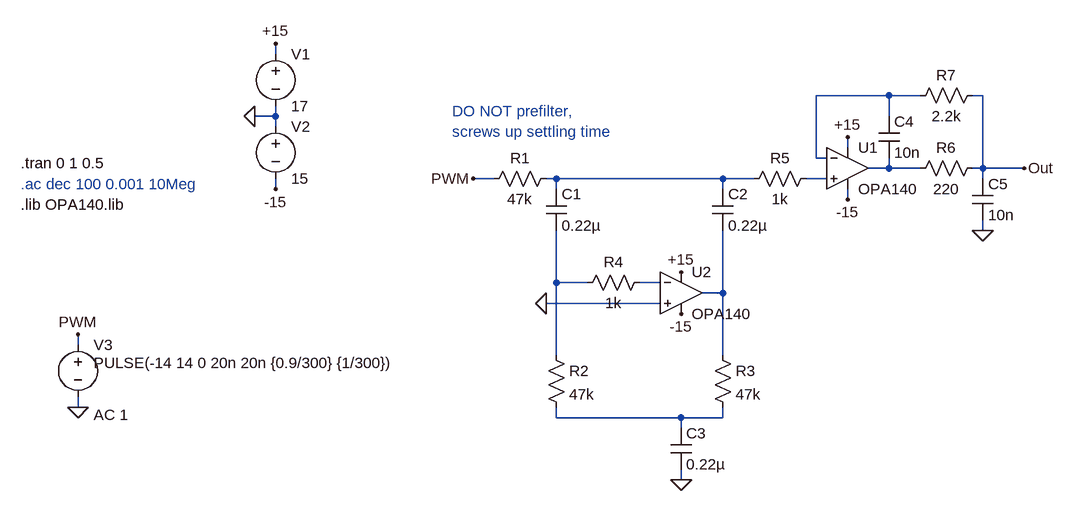
[diagram p0: schematic DC accurate LPF.asc]
DC accurate LPF.asc, the LTspice schematic file:
Version 4
SHEET 1 1356 1140
WIRE -320 -16 -320 -32
WIRE 624 48 512 48
WIRE 672 48 624 48
WIRE 768 48 752 48
WIRE -320 80 -320 64
WIRE -320 80 -352 80
WIRE 624 80 624 48
WIRE -320 96 -320 80
WIRE 560 128 560 112
WIRE 512 144 512 48
WIRE 528 144 512 144
WIRE 624 160 624 144
WIRE 624 160 592 160
WIRE 672 160 624 160
WIRE 768 160 768 48
WIRE 768 160 752 160
WIRE 832 160 768 160
WIRE 16 176 -16 176
WIRE 112 176 96 176
WIRE 368 176 112 176
WIRE 416 176 368 176
WIRE 528 176 496 176
WIRE 768 176 768 160
WIRE -320 192 -320 176
WIRE 112 192 112 176
WIRE 368 192 368 176
WIRE 560 208 560 192
WIRE 768 256 768 240
WIRE 112 336 112 256
WIRE 160 336 112 336
WIRE 272 336 240 336
WIRE 368 352 368 256
WIRE 368 352 336 352
WIRE 272 368 96 368
WIRE -624 432 -624 416
WIRE 112 448 112 336
WIRE 368 448 368 352
WIRE -624 528 -624 512
WIRE 112 544 112 528
WIRE 304 544 112 544
WIRE 368 544 368 528
WIRE 368 544 304 544
WIRE 304 560 304 544
WIRE 304 640 304 624
FLAG -352 80 0
FLAG 560 112 +15
FLAG 304 320 +15
FLAG 96 368 0
FLAG 304 640 0
FLAG 304 384 -15
FLAG -624 528 0
FLAG 832 160 Out
FLAG -320 -32 +15
FLAG -320 192 -15
FLAG 560 208 -15
FLAG -624 416 PWM
FLAG -16 176 PWM
FLAG 768 256 0
SYMBOL OpAmps\\opamp2 560 96 R0
SYMATTR InstName U1
SYMATTR Value OPA140
SYMBOL voltage -320 -32 R0
WINDOW 123 0 0 Left 0
WINDOW 39 0 0 Left 0
SYMATTR InstName V1
SYMATTR Value 17
SYMBOL voltage -320 80 R0
WINDOW 123 0 0 Left 0
WINDOW 39 0 0 Left 0
SYMATTR InstName V2
SYMATTR Value 15
SYMBOL res 112 160 R90
WINDOW 0 0 56 VBottom 2
WINDOW 3 32 56 VTop 2
SYMATTR InstName R1
SYMATTR Value 47k
SYMBOL cap 96 192 R0
SYMATTR InstName C1
SYMATTR Value 0.22µ
SYMBOL cap 352 192 R0
SYMATTR InstName C2
SYMATTR Value 0.22µ
SYMBOL OpAmps\\opamp2 304 288 R0
SYMATTR InstName U2
SYMATTR Value OPA140
SYMBOL res 96 432 R0
SYMATTR InstName R2
SYMATTR Value 47k
SYMBOL res 352 432 R0
SYMATTR InstName R3
SYMATTR Value 47k
SYMBOL voltage -624 416 R0
WINDOW 123 24 124 Left 2
WINDOW 39 0 0 Left 0
WINDOW 3 24 44 Left 2
SYMATTR Value2 AC 1
SYMATTR Value PULSE(-14 14 0 20n 20n {0.9/300} {1/300})
SYMATTR InstName V3
SYMBOL cap 288 560 R0
SYMATTR InstName C3
SYMATTR Value 0.22µ
SYMBOL res 256 320 R90
WINDOW 0 0 56 VBottom 2
WINDOW 3 32 56 VTop 2
SYMATTR InstName R4
SYMATTR Value 1k
SYMBOL res 512 160 R90
WINDOW 0 0 56 VBottom 2
WINDOW 3 32 56 VTop 2
SYMATTR InstName R5
SYMATTR Value 1k
SYMBOL res 768 144 R90
WINDOW 0 0 56 VBottom 2
WINDOW 3 32 56 VTop 2
SYMATTR InstName R6
SYMATTR Value 220
SYMBOL cap 752 176 R0
SYMATTR InstName C5
SYMATTR Value 10n
SYMBOL res 768 32 R90
WINDOW 0 0 56 VBottom 2
WINDOW 3 32 56 VTop 2
SYMATTR InstName R7
SYMATTR Value 2.2k
SYMBOL cap 608 80 R0
SYMATTR InstName C4
SYMATTR Value 10n
TEXT -712 216 Left 2 !.lib OPA140.lib
TEXT -712 184 Left 2 ;.ac dec 100 0.001 10Meg
TEXT -48 72 Left 2 ;DO NOT prefilter,\nscrews up settling time
TEXT -712 152 Left 2 !.tran 0 1 0.5

The netlist it stands for:
* DC accurate LPF.asc
XU1 N004 N001 +15 -15 N002 OPA140  ; pins In+ In- V+ V- OUT
V1 +15 0 17
V2 0 -15 15
R1 N003 PWM 47k
C1 N003 N005 0.22µ
C2 N003 N007 0.22µ
XU2 0 N006 +15 -15 N007 OPA140  ; pins In+ In- V+ V- OUT
R2 N005 N008 47k
R3 N007 N008 47k
V3 PWM 0 PULSE(-14 14 0 20n 20n {0.9/300} {1/300}) AC 1
C3 N008 0 0.22µ
R4 N006 N005 1k
R5 N004 N003 1k
R6 Out N002 220
C5 Out 0 10n
R7 Out N001 2.2k
C4 N001 N002 10n
.lib OPA140.lib
* .ac dec 100 0.001 10Meg
* DO NOT prefilter,
* screws up settling time
.tran 0 1 0.5
.backanno
.end